# Altium schematic sheet 4 jtag uart.SchDoc
size A4; SheetNumber: 4; SheetTotal: 13
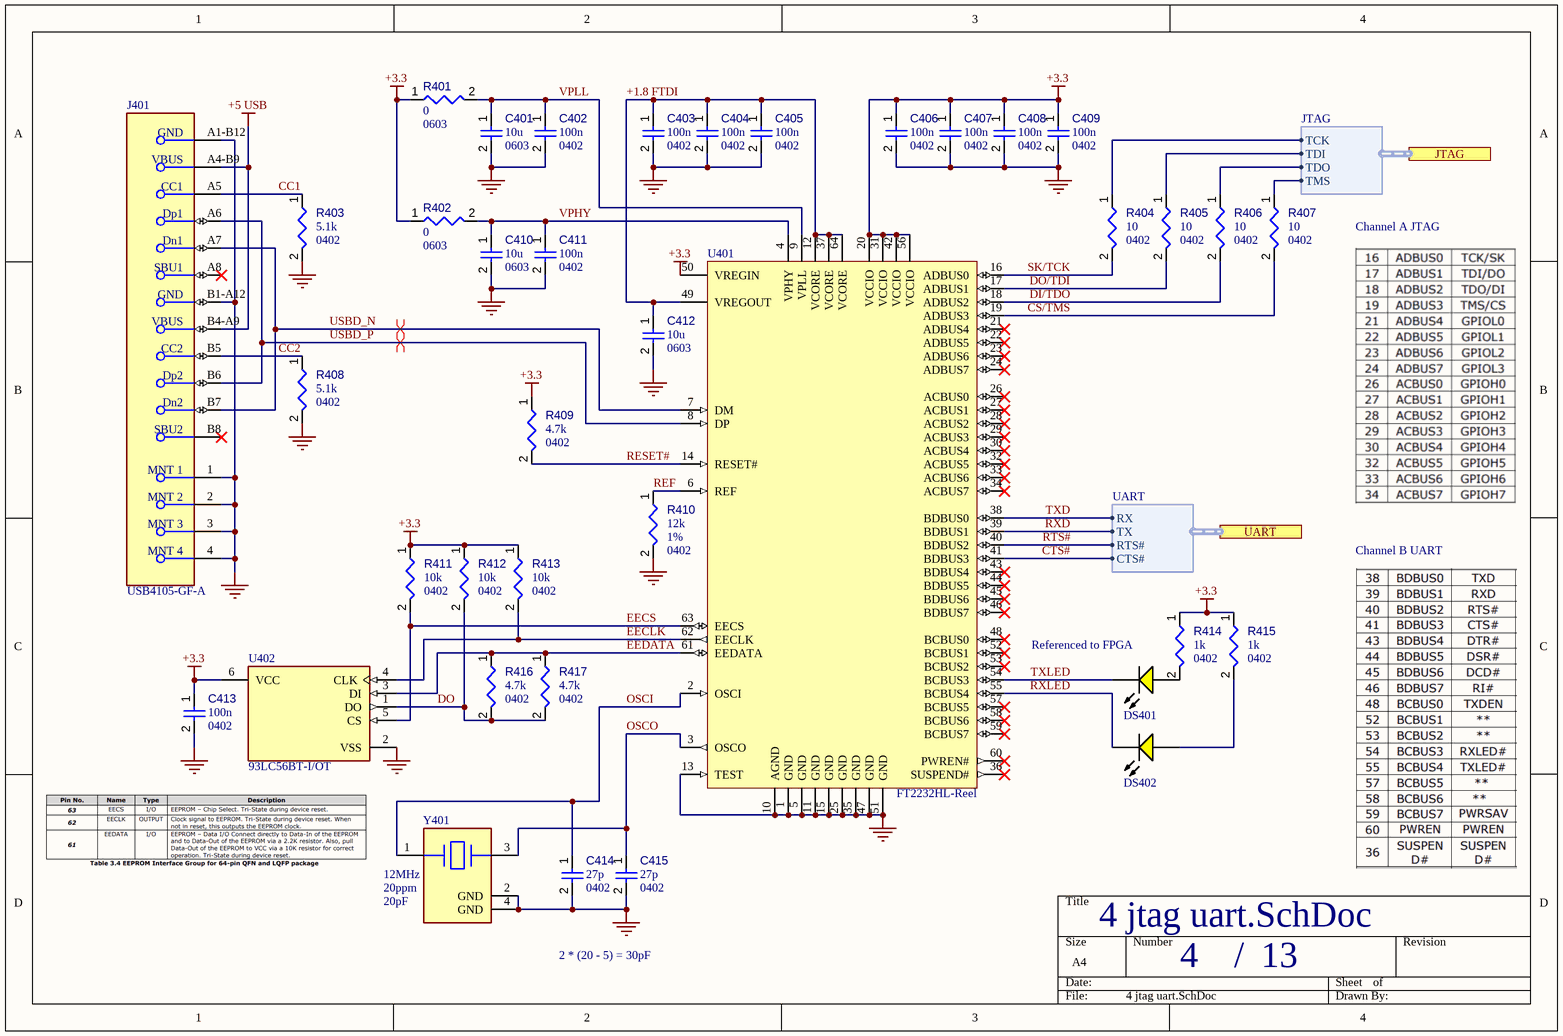
[diagram p0: 4 jtag uart.SchDoc]

## Parts
C401  value 10u  Case/Package: 0603  [CAPC0603(1608)100_L]  (hidden comment: Capacitors,0603,10u)
C402  value 100n  Case/Package: 0402  [CAPC0402(1005)60_L]  (hidden comment: Capacitors,0402,100n,16)
C403  value 100n  Case/Package: 0402  [CAPC0402(1005)60_L]  (hidden comment: Capacitors,0402,100n,16)
C404  value 100n  Case/Package: 0402  [CAPC0402(1005)60_L]  (hidden comment: Capacitors,0402,100n,16)
C405  value 100n  Case/Package: 0402  [CAPC0402(1005)60_L]  (hidden comment: Capacitors,0402,100n,16)
C406  value 100n  Case/Package: 0402  [CAPC0402(1005)60_L]  (hidden comment: Capacitors,0402,100n,16)
C407  value 100n  Case/Package: 0402  [CAPC0402(1005)60_L]  (hidden comment: Capacitors,0402,100n,16)
C408  value 100n  Case/Package: 0402  [CAPC0402(1005)60_L]  (hidden comment: Capacitors,0402,100n,16)
C409  value 100n  Case/Package: 0402  [CAPC0402(1005)60_L]  (hidden comment: Capacitors,0402,100n,16)
C410  value 10u  Case/Package: 0603  [CAPC0603(1608)100_L]  (hidden comment: Capacitors,0603,10u)
C411  value 100n  Case/Package: 0402  [CAPC0402(1005)60_L]  (hidden comment: Capacitors,0402,100n,16)
C412  value 10u  Case/Package: 0603  [CAPC0603(1608)100_L]  (hidden comment: Capacitors,0603,10u)
C413  value 100n  Case/Package: 0402  [CAPC0402(1005)60_L]  (hidden comment: Capacitors,0402,100n,16)
C414  value 27p  Case/Package: 0402  [CAPC0402(1005)60_L]  (hidden comment: Capacitors,0402,27p)
C415  value 27p  Case/Package: 0402  [CAPC0402(1005)60_L]  (hidden comment: Capacitors,0402,27p)
DS401  SML-LX0603YW-TR  [LUMX-SML-LX0603_V]  (value not drawn)
DS402  SML-LX0603YW-TR  [LUMX-SML-LX0603_V]  (value not drawn)
J401  USB4105-GF-A  [FP-USB4105-GF-A-MFG]
R401  value 0  Case/Package: 0603  [RESC0603(1608)_L]  (hidden comment: Resistors,0603,0)
R402  value 0  Case/Package: 0603  [RESC0603(1608)_L]  (hidden comment: Resistors,0603,0)
R403  value 5.1k  Case/Package: 0402  [RESC0402(1005)_L]  (hidden comment: Resistors,0402,5.1k)
R404  value 10  Case/Package: 0402  [RESC0402(1005)_L]  (hidden comment: Resistors,0402,10)
R405  value 10  Case/Package: 0402  [RESC0402(1005)_L]  (hidden comment: Resistors,0402,10)
R406  value 10  Case/Package: 0402  [RESC0402(1005)_L]  (hidden comment: Resistors,0402,10)
R407  value 10  Case/Package: 0402  [RESC0402(1005)_L]  (hidden comment: Resistors,0402,10)
R408  value 5.1k  Case/Package: 0402  [RESC0402(1005)_L]  (hidden comment: Resistors,0402,5.1k)
R409  value 4.7k  Case/Package: 0402  [RESC0402(1005)_L]  (hidden comment: Resistors,0402,4.7k)
R410  value 12k  Case/Package: 0402  Tolerance: 1%  [RESC0402(1005)_L]  (hidden comment: Resistors,0402,1%,12k)
R411  value 10k  Case/Package: 0402  [RESC0402(1005)_L]  (hidden comment: Resistors,0402,10k)
R412  value 10k  Case/Package: 0402  [RESC0402(1005)_L]  (hidden comment: Resistors,0402,10k)
R413  value 10k  Case/Package: 0402  [RESC0402(1005)_L]  (hidden comment: Resistors,0402,10k)
R414  value 1k  Case/Package: 0402  [RESC0402(1005)_L]  (hidden comment: Resistors,0402,1k)
R415  value 1k  Case/Package: 0402  [RESC0402(1005)_L]  (hidden comment: Resistors,0402,1k)
R416  value 4.7k  Case/Package: 0402  [RESC0402(1005)_L]  (hidden comment: Resistors,0402,4.7k)
R417  value 4.7k  Case/Package: 0402  [RESC0402(1005)_L]  (hidden comment: Resistors,0402,4.7k)
U401  FT2232HL-Reel  [LQFP-64_L]
U402  93LC56BT-I/OT  [FP-C04-028-MFG]
Y401  Frequency: 12MHz  Frequency Stability: 20ppm  Load Capacitance: 20pF  [FP-NX3225SA-MFG]  (hidden comment: NX3225SA-12.000M-STD-CRS-2)

## Ports
JTAG (harness JTAG), UART (harness UART)

## Harnesses
UART: TX, RX, RTS#, CTS#
JTAG: TCK, TDI, TDO, TMS

## Nets
+3.3: C406.1 C407.1 C408.1 C409.1 C413.1 R401.1 R402.1 R409.1 R411.1 R412.1 R413.1 R414.1 R415.1 U401.20(VCCIO) U401.31(VCCIO) U401.42(VCCIO) U401.50(VREGIN) U401.56(VCCIO) U402.6(VCC)
+5 USB: J401.A4-B9(VBUS) J401.B4-A9(VBUS)
GND: C401.2 C402.2 C403.2 C404.2 C405.2 C406.2 C407.2 C408.2 C409.2 C410.2 C411.2 C412.2 C413.2 C414.2 C415.2 J401.1(MNT_1) J401.2(MNT_2) J401.3(MNT_3) J401.4(MNT_4) J401.A1-B12(GND) J401.B1-A12(GND) R403.2 R408.2 R410.2 U401.1(GND) U401.5(GND) U401.10(AGND) U401.11(GND) U401.13(TEST) U401.15(GND) U401.25(GND) U401.35(GND) U401.47(GND) U401.51(GND) U402.2(VSS) Y401.2(GND) Y401.4(GND)
+1.8 FTDI: C403.1 C404.1 C405.1 C412.1 U401.12(VCORE) U401.37(VCORE) U401.49(VREGOUT) U401.64(VCORE)
CC1: J401.A5(CC1) R403.1
CC2: J401.B5(CC2) R408.1
CS/TMS: R407.2 U401.19(ADBUS3)
CTS#: U401.41(BDBUS3) ; port UART.CTS#
DI/TDO: R406.2 U401.18(ADBUS2)
DO: R412.2 R416.2 R417.2 U402.1(DO)
DO/TDI: R405.2 U401.17(ADBUS1)
EECLK: R413.2 U401.62(EECLK) U402.4(CLK)
EECS: R411.2 U401.63(EECS) U402.5(CS)
EEDATA: R416.1 R417.1 U401.61(EEDATA) U402.3(DI)
OSCI: C414.1 U401.2(OSCI) Y401.1
OSCO: C415.1 U401.3(OSCO) Y401.3
REF: R410.1 U401.6(REF)
RESET#: R409.2 U401.14(RESET#)
RTS#: U401.40(BDBUS2) ; port UART.RTS#
RXD: U401.39(BDBUS1) ; port UART.TX
RXLED: DS402.2(K) U401.55(BCBUS4)
SK/TCK: R404.2 U401.16(ADBUS0)
TXD: U401.38(BDBUS0) ; port UART.RX
TXLED: DS401.2(K) U401.54(BCBUS3)
USBD_N: J401.A7(Dn1) J401.B7(Dn2) U401.7(DM)
USBD_P: J401.A6(Dp1) J401.B6(Dp2) U401.8(DP)
VPHY: C410.1 C411.1 R402.2 U401.4(VPHY)
VPLL: C401.1 C402.1 R401.2 U401.9(VPLL)
NetDS401_1: DS401.1(A) R414.2
NetDS402_1: DS402.1(A) R415.2
NetR404_1: R404.1 ; port JTAG.TCK
NetR405_1: R405.1 ; port JTAG.TDI
NetR406_1: R406.1 ; port JTAG.TDO
NetR407_1: R407.1 ; port JTAG.TMS

Not connected (* = marked no-connect by the designer): J401 A8(SBU1)* B8(SBU2)*; U401 21(ADBUS4)* 22(ADBUS5)* 23(ADBUS6)* 24(ADBUS7)* 26(ACBUS0)* 27(ACBUS1)* 28(ACBUS2)* 29(ACBUS3)* 30(ACBUS4)* 32(ACBUS5)* 33(ACBUS6)* 34(ACBUS7)* 36(SUSPEND#)* 43(BDBUS4)* 44(BDBUS5)* 45(BDBUS6)* 46(BDBUS7)* 48(BCBUS0)* 52(BCBUS1)* 53(BCBUS2)* 57(BCBUS5)* 58(BCBUS6)* 59(BCBUS7)* 60(PWREN#)*

## Layout directives
differential pair: USBD_N, USBD_P

## Notes on the sheet
- Channel A JTAG
- Channel B UART
- Referenced to FPGA
- 2 * (20 - 5) = 30pF
- /

## Library data of the parts
C401 C410 C412 C414 C415 = Capacitors: Capacitor; Component Type: Capacitors
C402-C409 C411 C413 = Capacitors: Capacitor; Voltage Rating: 16; Component Type: Capacitors
DS401 DS402 = CMP-2000-07121-1: Yellow LED, Milky White Diffused Lens, 2.1 V, 14 mcd, -25 to 85 degC, 2-Pin SMD, RoHS, Tape and Reel; Manufacturer: Lumex; COO: CN; Number of LEDs: 1; Type: Uni-Color; Intensity: 14mcd; Reverse Voltage: 5(Min)V; LED Material: GaAsP; Viewing Angle: 160; Peak Wavelength: 585nm; Pin_Count: 2; Lens Appearance: ColorlessDiffused; Operating Temperature: -25to85C; Color: Yellow; Mounting Technology: SurfaceMount; Package Description: 2-Pin Surface Mount Device, Body 1.6 x 0.8 mm; Mounting: SurfaceMount; Packaging: TapeandReel; RoHS: Unknown; Supplier_Package: SMD; Package Reference: SML-LX00603; Part No: SML-LX0603YW-TR; Datasheet URL: http://www.lumex.com/content/files/ProductAttachment/SML-LX0603YW-TR.pdf; Dimension: 1.6x0.8x0.6mm; Manufacturer URL: http://www.lumexinstruments.com/; HTS: 8541402000; Datasheet Version: Rev. G, 09/2013; Lens Dimensions: 1x0.8x0.3mm; Dominant Wavelength: N/A; ECCN: EARII; Supplier: Lumex; Family: SML-LX0603YW
J401 = CMP-245163-000001-1: CONN RCPT USB2.0 TYPEC 5A; Manufacturer: GCT; Voltage Rating: 20V; Is Female: yes; Current Rating: 5/6.25/1.25/0.25A; Number Of Contacts: 16; Conn Orientation: Right Angle; Device Class L1: Connectors; Category: Conn; Lead Free: Yes; RoHS: TRUE; Temperature Range High: +85°C; Digikey Description: CONN RCPT USB2.0 TYPEC 5A; Device Class L3: unset; ComponentLink2Description: Datasheet; Manufacturer Part Number: USB4105-GF-A; Package: 0; Usb Standard: USB 2.0; Device Class L2: USB Connectors; Automotive: No; Temperature Range Low: -40°C; Height: 3.46mm; Temperature: -40°C to +85°C; Contact Material: Gold,Nickel; ComponentLink2URL: https://gct.co/files/drawings/usb4105.pdf; Octopart: https://octopart.com/usb4105-gf-a-gct-106627878
R401-R417 = Resistors: Resistor; Component Type: Resistors
U401 = CMP-0078-00023-3: Dual High Speed USB To Multipurpose UART/FIFO IC, 64-pin LQFP, Tape and Reel; Manufacturer: FTDI; DatasheetVersion: ver 2.21, Jun-2012; ComponentLink1URL: http://www.ftdichip.com/; PartNumber: FT2232HL-Reel; ComponentLink2Description: Datasheet; RevisionNote: DatasheetVersion updated to 2.21 Jun-2012; PackageVersion: Jun-12; ComponentLink1Description: Manufacturer URL; ComponentLink2URL: http://www.ftdichip.com/Support/Documents/DataSheets/ICs/DS_FT2232H.pdf; PackageReference: LQFP-64; PackageDescription: 64-Pin Thin Quad Flat Pack, 10 x 10 x 1.4 mm Body, 0.5 mm Pitch
U402 = CMP-0162-00356-2: IC EEPROM 2K SPI 2MHZ SOT23-6; Access Time: 250ns; Density: 2Kb; Max Supply Voltage: 5.5V; Interface: Serial; Min Supply Voltage: 2.5V; Nominal Supply Current: 2mA; Number of Pins: 6; Radiation Hardening: No; Length: 3.1mm; Height: 1.3mm; Min Operating Temperature: -40°C; Max Operating Temperature: 85°C; Lead Free: Lead Free; Memory Type: EEPROM; Contact Plating: Tin; REACH SVHC: No SVHC; Package Quantity: 3000; Frequency: 2MHz; Width: 1.8mm; Max Frequency: 2MHz; Case/Package: SOT-23; Mount: Surface Mount; Packaging: Tape and Reel; Memory Size: 2Kb
Y401 = CMP-200220-000016-1: Frequency Tolerance: 10ppm; ESR (Equivalent Series Resistance): 50R; Case/Package: SMD/SMT; RoHS Compliant: Yes; Mount: Surface Mount; Ratings: AEC-Q200; Length: 0.126inch; Packaging: Tape and Reel; Width: 0.098inch; Min Operating Temperature: -40°C; Height: 0.024inch; Max Operating Temperature: 125°C